# EAGLE design msgeq7ctrler_Elektor (EAGLE 7.2.0)
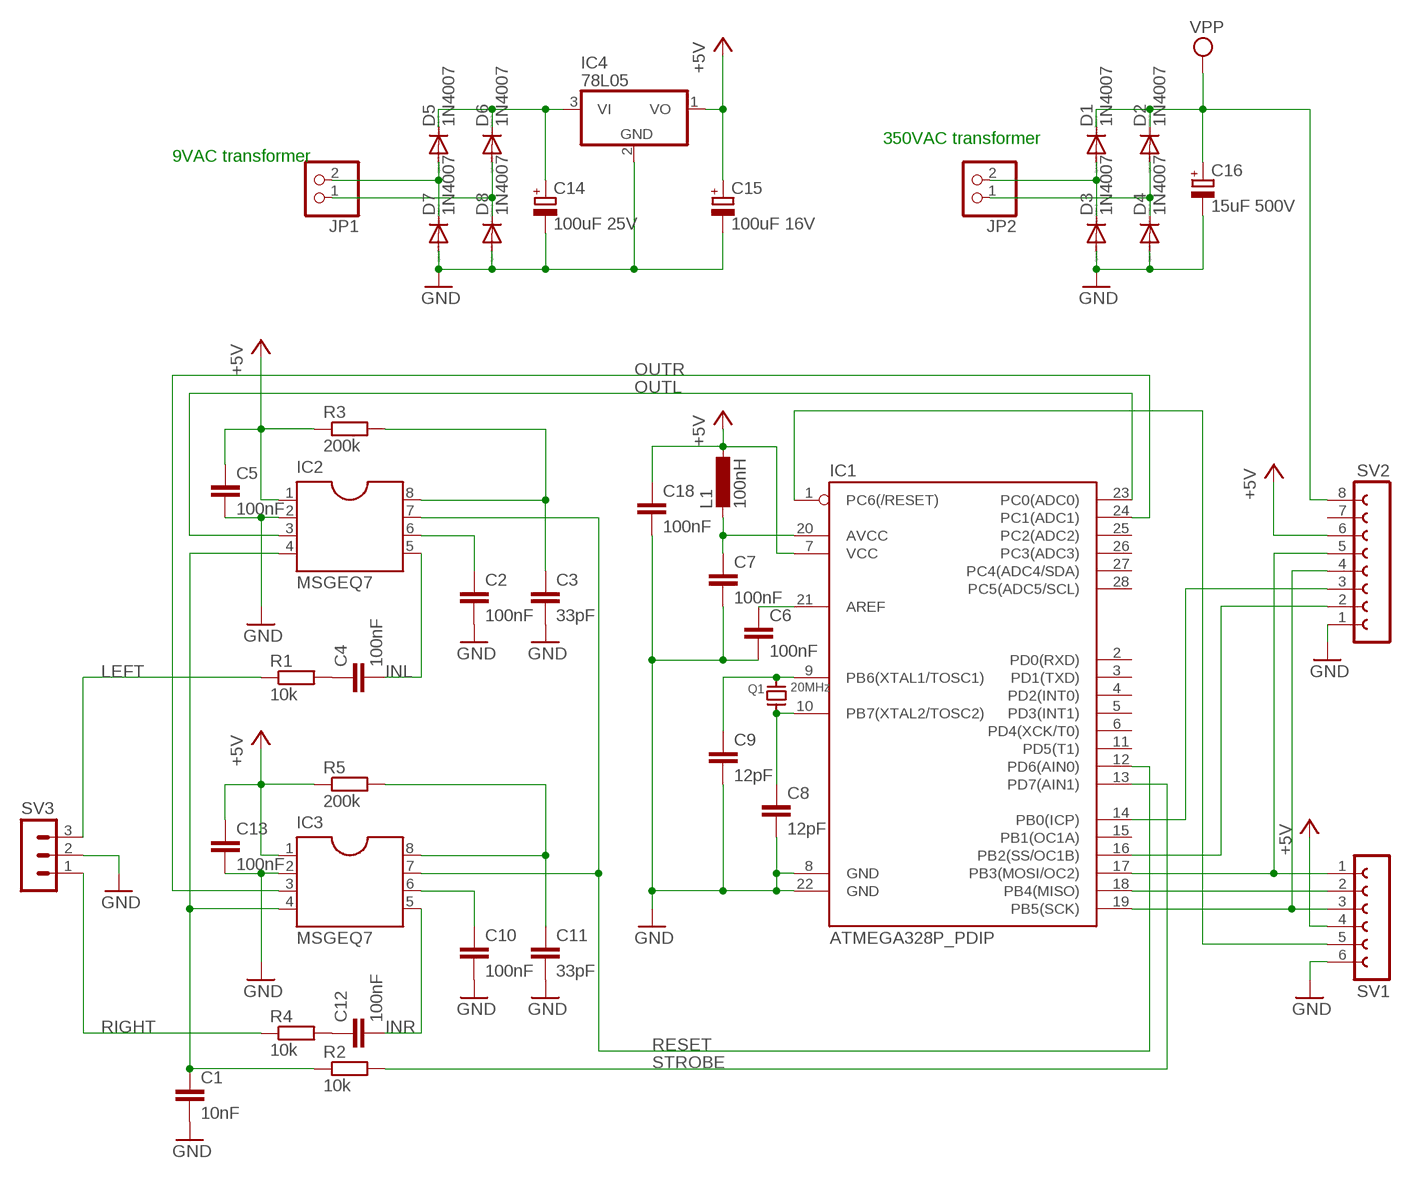
[diagram p0: schematic, sheet 1]

## Parts
C1  10nF  C-EU025-025X050  [C025-025X050]
C2  100nF  C-EU025-025X050  [C025-025X050]
C3  33pF  C-EU025-025X050  [C025-025X050]
C4  100nF  C-EU025-025X050  [C025-025X050]
C5  100nF  C-EU025-025X050  [C025-025X050]
C6  100nF  C-EU025-025X050  [C025-025X050]
C7  100nF  C-EU025-025X050  [C025-025X050]
C8  12pF  C-EU025-025X050  [C025-025X050]
C9  12pF  C-EU025-025X050  [C025-025X050]
C10  100nF  C-EU025-025X050  [C025-025X050]
C11  33pF  C-EU025-025X050  [C025-025X050]
C12  100nF  C-EU025-025X050  [C025-025X050]
C13  100nF  C-EU025-025X050  [C025-025X050]
C14  100uF 25V  CPOL-EUE2,5-6E  [E2,5-6E]
C15  100uF 16V  CPOL-EUE2,5-6E  [E2,5-6E]
C16  15uF 500V  CPOL-EUE10-20  [EB20D]
C18  100nF  C-EU025-025X050  [C025-025X050]
D1  1N4007  1N4004  [DO41-10]
D2  1N4007  1N4004  [DO41-10]
D3  1N4007  1N4004  [DO41-10]
D4  1N4007  1N4004  [DO41-10]
D5  1N4007  1N4004  [DO41-10]
D6  1N4007  1N4004  [DO41-10]
D7  1N4007  1N4004  [DO41-10]
D8  1N4007  1N4004  [DO41-10]
IC1  ATMEGA328P_PDIP  [DIL28-3]
IC2  MSGEQ7  DIL08  [DIL08]
IC3  MSGEQ7  DIL08  [DIL08]
IC4  78L05  78LXX  [TO92SIL]
JP1  PINHD-1X2  [1X02]
JP2  PINHD-1X2  [1X02]
L1  100nH  L-EU0207/10  [0207/10]
Q1  20MHz  XTAL  [XTAL]
R1  10k  R-EU_0207/12  [0207/12]
R2  10k  R-EU_0207/12  [0207/12]
R3  200k  R-EU_0207/12  [0207/12]
R4  10k  R-EU_0207/12  [0207/12]
R5  200k  R-EU_0207/12  [0207/12]
SV1  FE06-1  [FE06]
SV2  FE08-1  [FE08]
SV3  MA03-1  [MA03-1]

## Nets
+5V: C5.1 C13.1 C15.+ C18.1 IC1.7(VCC) IC2.1 IC3.1 IC4.1(VO) L1.1 R3.1 R5.1 SV1.4 SV2.6
GND: C1.2 C2.2 C3.2 C5.2 C6.2 C7.2 C8.2 C9.2 C10.2 C11.2 C13.2 C14.- C15.- C16.- C18.2 D3.A D4.A D7.A D8.A IC1.8(GND) IC1.22(GND) IC2.2 IC3.2 IC4.2(GND) SV1.6 SV2.1 SV3.2
INL: C4.2 IC2.5
INR: C12.2 IC3.5
LEFT: R1.1 SV3.3
N$2: C3.1 IC2.8 R3.2
N$3: C4.1 R1.2
N$5: C9.1 IC1.9(PB6(XTAL1/TOSC1)) Q1.P$2
N$6: C8.1 IC1.10(PB7(XTAL2/TOSC2)) Q1.P$1
N$7: C7.1 IC1.20(AVCC) L1.2
N$8: C6.1 IC1.21(AREF)
N$9: IC1.19(PB5(SCK)) SV1.3 SV2.4
N$10: IC1.18(PB4(MISO)) SV1.2
N$11: IC1.17(PB3(MOSI/OC2)) SV1.1 SV2.5
N$12: IC1.1(PC6(/RESET)) SV1.5
N$13: IC1.16(PB2(SS/OC1B)) SV2.2
N$14: IC1.14(PB0(ICP)) SV2.3
N$15: C11.1 IC3.8 R5.2
N$16: C12.1 R4.2
N$17: D1.A D3.C JP2.2
N$18: D2.A D4.C JP2.1
N$19: D5.A D7.C JP1.2
N$20: D6.A D8.C JP1.1
OUTL: IC1.23(PC0(ADC0)) IC2.3
OUTR: IC1.24(PC1(ADC1)) IC3.3
RESET: IC1.12(PD6(AIN0)) IC2.7 IC3.7
RIGHT: R4.1 SV3.1
STROBE: IC1.13(PD7(AIN1)) R2.2
STROBE_RC: C1.1 IC2.4 IC3.4 R2.1
VGND: C2.1 IC2.6
VGND1: C10.1 IC3.6
VPP: C16.+ D1.C D2.C SV2.8
VPP1: C14.+ D5.C D6.C IC4.3(VI)
Unconnected: IC1.2(PD0(RXD)) IC1.3(PD1(TXD)) IC1.4(PD2(INT0)) IC1.5(PD3(INT1)) IC1.6(PD4(XCK/T0)) IC1.11(PD5(T1)) IC1.15(PB1(OC1A)) IC1.25(PC2(ADC2)) IC1.26(PC3(ADC3)) IC1.27(PC4(ADC4/SDA)) IC1.28(PC5(ADC5/SCL)) SV2.7

## Notes on the sheet
- 350VAC transformer
- 9VAC transformer

## Library data of the parts
C1-C13 C18 = rcl:C-EU: CAPACITOR, European symbol
C14-C16 = rcl:CPOL-EU: POLARIZED CAPACITOR, European symbol
D1-D8 = diode:1N4004: DIODE general purpose rectifier, 1 A
IC1 = SparkFun-DigitalIC:ATMEGA328P_PDIP: uC used in the Arduino 32kb flash, 1k EEPROM, 2k SRAM This is the through-hole version of this chip.
IC2 IC3 = cvdo-dil-packages:DIL08
IC4 = 78xx79xxSIL:78LXX
JP1 JP2 = pinhead:PINHD-1X2: PIN HEADER
L1 = rcl:L-EU: INDUCTOR, European symbol
Q1 = xtal-cvdo:XTAL
R1-R5 = rcl:R-EU_: RESISTOR, European symbol
SV1 = con-lsta:FE06-1: FEMALE HEADER; OC_FARNELL: unknown; OC_NEWARK: unknown
SV2 = con-lsta:FE08-1: FEMALE HEADER; OC_FARNELL: unknown; OC_NEWARK: unknown
SV3 = con-lstb:MA03-1: PIN HEADER; OC_FARNELL: unknown; OC_NEWARK: unknown

## Board
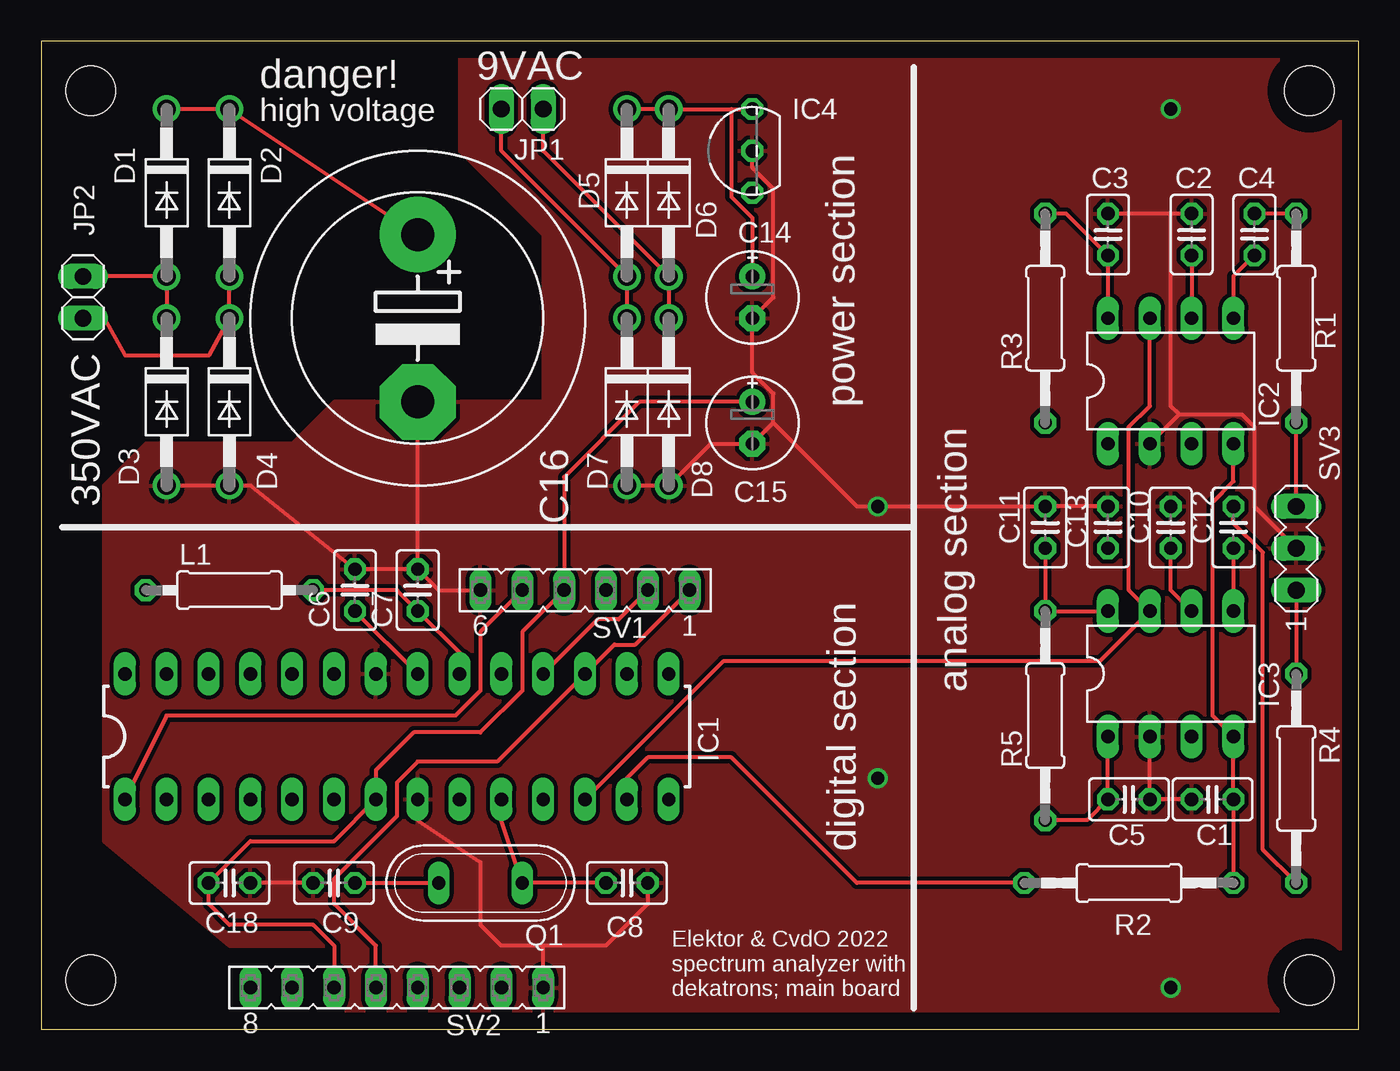
[diagram p1: board, top side]
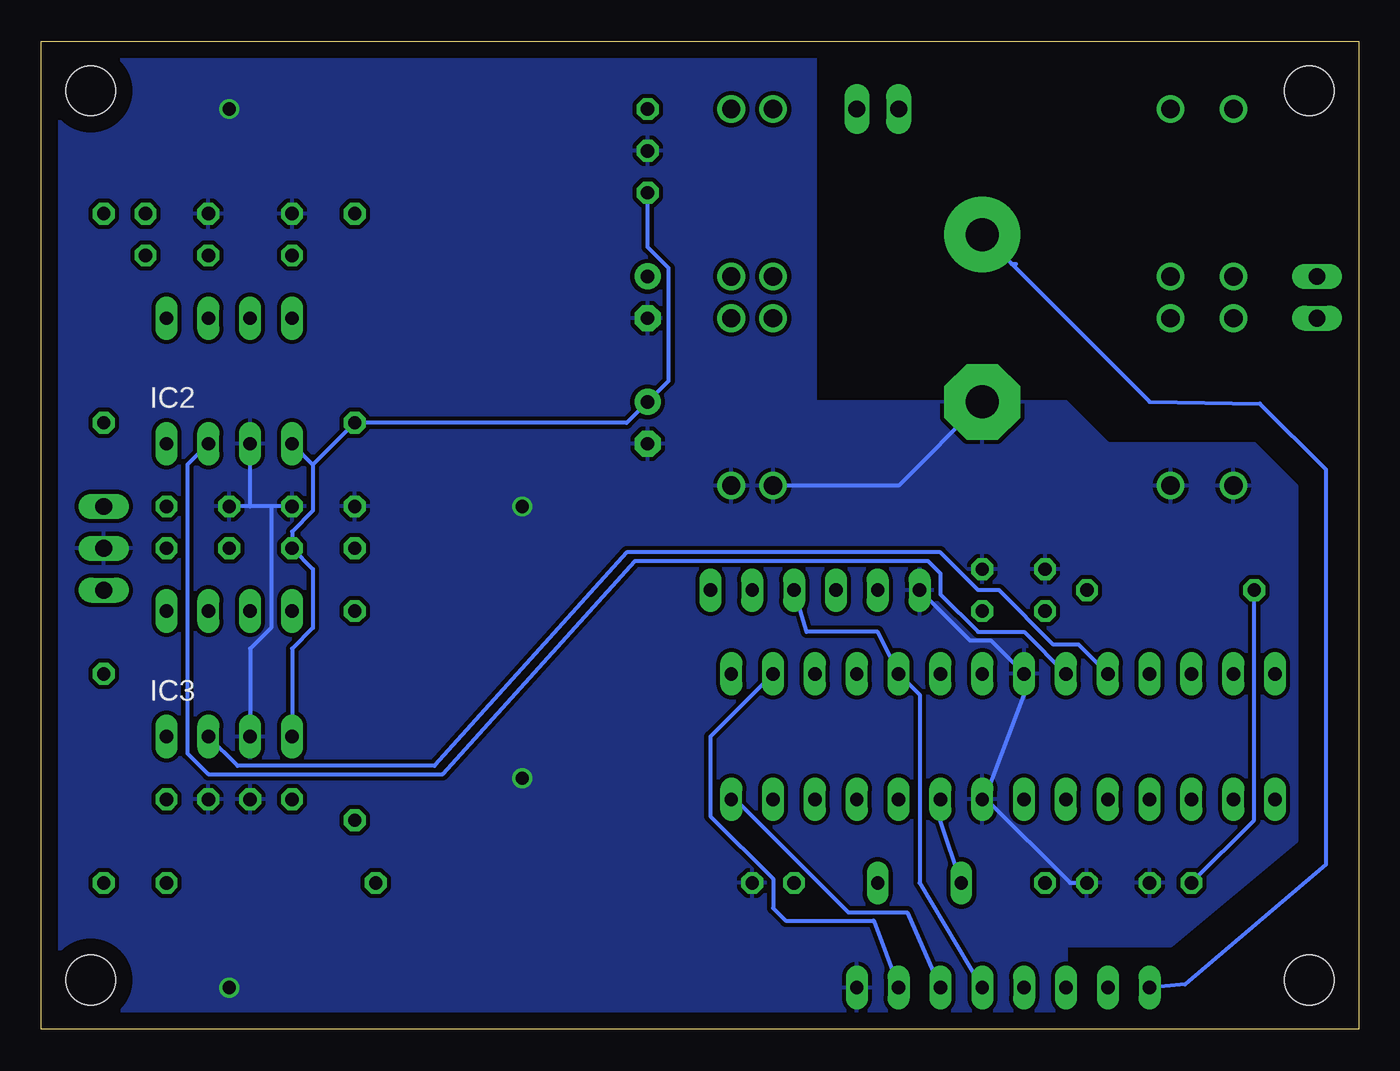
[diagram p2: board, bottom side, seen from below]

Size 80 x 60 mm. Coordinates in mm from the lower left corner, seen from the top.
Outline: 0,0 80,0 80,60 0,60 0,0
Copper layers (1*16): Top 0.035mm / dielectric 1.5mm / Bottom 0.035mm
Design rules "default *": minimum track width 10mil, minimum drill 24mil, track to track 10mil, track to pad 10mil, pad to pad 10mil, via to via 10mil, smd to smd 8mil, copper to edge 40mil, drill to drill 10mil, minimum pad ring 10mil, minimum via ring 8mil, stop-mask expansion 4mil, vias tented up to drill 0mil, thermal gap 10mil
Holes 3 mm at 3,3 77,3 77,57 3,57

### Footprints (pad centres in the part's own frame; a part is rotated, then mirrored left to right if it is on the bottom)
C025-025X050 = drill 0.813 octagon: 1 -1.27,0; 2 1.27,0
E2,5-6E = drill 0.813 pad 1.575: + -1.27,0 | drill 0.813 pad 1.575 octagon: - 1.27,0
EB20D = drill 2.007 pad 4.597: + -5.08,0 | drill 2.007 pad 4.597 octagon: - 5.08,0
DO41-10 = drill 1.118: A 5.08,0; C -5.08,0
DIL28-3 = drill 0.813 long: 1 -16.51,-3.81; 2 -13.97,-3.81; 3 -11.43,-3.81; 4 -8.89,-3.81; 5 -6.35,-3.81; 6 -3.81,-3.81; 7 -1.27,-3.81; 8 1.27,-3.81; 9 3.81,-3.81; 10 6.35,-3.81; 11 8.89,-3.81; 12 11.43,-3.81; 13 13.97,-3.81; 14 16.51,-3.81; 15 16.51,3.81; 16 13.97,3.81; 17 11.43,3.81; 18 8.89,3.81; 19 6.35,3.81; 20 3.81,3.81; 21 1.27,3.81; 22 -1.27,3.81; 23 -3.81,3.81; 24 -6.35,3.81; 25 -8.89,3.81; 26 -11.43,3.81; 27 -13.97,3.81; 28 -16.51,3.81
DIL08 = drill 0.813 long: 1 -2.54,-2.54; 2 0,-2.54; 3 2.54,-2.54; 4 5.08,-2.54; 5 5.08,5.08; 6 2.54,5.08; 7 0,5.08; 8 -2.54,5.08
TO92SIL = drill 0.813 octagon: 1 -2.54,0; 2 0,0; 3 2.54,0
1X02 = drill 1.016 long: 1 -1.27,0; 2 1.27,0
0207/10 = drill 0.813 octagon: 1 -5.08,0; 2 5.08,0
XTAL = drill 0.8 long: P$1 -2.54,0; P$2 2.54,0
0207/12 = drill 0.813 octagon: 1 -6.35,0; 2 6.35,0
FE06 = drill 0.813 long: 1 -6.35,0; 2 -3.81,0; 3 -1.27,0; 4 1.27,0; 5 3.81,0; 6 6.35,0
FE08 = drill 0.813 long: 1 -8.89,0; 2 -6.35,0; 3 -3.81,0; 4 -1.27,0; 5 1.27,0; 6 3.81,0; 7 6.35,0; 8 8.89,0
MA03-1 = drill 1.016 long: 1 -2.54,0; 2 0,0; 3 2.54,0

### Placement (x,y rotation side)
C1  71.12,13.97 180 top
C2  69.85,48.26 90 top
C3  64.77,48.26 90 top
C4  73.66,48.26 270 top
C5  66.04,13.97 0 top
C6  19.05,26.67 90 top
C7  22.86,26.67 90 top
C8  35.56,8.89 0 top
C9  17.78,8.89 180 top
C10  68.58,30.48 90 top
C11  60.96,30.48 90 top
C12  72.39,30.48 270 top
C13  64.77,30.48 90 top
C14  43.18,44.45 270 top
C15  43.18,36.83 270 top
C16  22.86,43.18 270 top
C18  11.43,8.89 0 top
D1  7.62,50.8 270 top
D2  11.43,50.8 270 top
D3  7.62,38.1 270 top
D4  11.43,38.1 270 top
D5  35.56,50.8 270 top
D6  38.1,50.8 270 top
D7  35.56,38.1 270 top
D8  38.1,38.1 270 top
IC1  21.59,17.78 0 top
IC2  67.31,38.1 0 top
IC3  67.31,20.32 0 top
IC4  43.18,53.34 90 top
JP1  29.21,55.88 180 top
JP2  2.54,44.45 90 top
L1  11.43,26.67 0 top
Q1  26.67,8.89 180 top
R1  76.2,43.18 90 top
R2  66.04,8.89 180 top
R3  60.96,43.18 90 top
R4  76.2,15.24 270 top
R5  60.96,19.05 90 top
SV1  33.02,26.67 180 top
SV2  21.59,2.54 180 top
SV3  76.2,29.21 90 top

### Tracks (layer width: path | path; a pad name or v marks a point on that pad's centre or on a via)
+5V
  Top 0.254: SV2.6 17.78,5.08 16.51,6.35 11.43,6.35 10.16,7.62 C18.1 12.7,11.43 17.78,11.43 IC1.7 20.32,15.75 22.61,18.03 26.67,18.03 29.21,20.57 29.21,24.13 SV1.4 31.75,33.53 36.32,38.1 C15.+ | R5.1 63.5,12.7 C5.1 IC3.1
  Bottom 0.254: L1.1 6.35,12.7 C18.1 | 63.5,34.29 63.5,31.5 64.77,30.23 C13.1 63.5,27.94 63.5,24.38 64.77,23.11 IC3.1 | IC2.1 63.5,34.29 | 63.5,34.29 R3.1 44.45,36.83 C15.+ 41.91,39.37 41.91,46.23 43.18,47.5 IC4.1
GND  (via drill 0.8)
  Top 0.254: C1.2 C5.2 IC3.2 | C2.2 68.58,49.53 | 68.58,49.53 C3.2 | C13.2 C11.2 v50.8,31.75 49.53,31.75 44.45,36.83 | SV3.2 73.66,31.75 73.66,36.58 72.9,37.34 69.09,37.34 | IC2.2 69.09,37.34 | 68.58,49.53 68.58,37.85 69.09,37.34 | C9.2 C18.2 | IC4.2 43.18,52.32 44.45,51.05 44.45,44.45 C14.- 43.18,39.88 44.45,38.61 44.45,36.83 | D7.A D8.A 40.64,35.56 C15.- 44.45,36.83 | D3.A D4.A 12.7,33.02 C6.2 C7.2 | SV1.6 24.13,26.67 C7.2 | C7.2 C16.- | IC1.8 22.86,12.7 26.67,10.16 26.67,6.35 27.94,5.08 30.48,5.08 | C8.2 36.83,7.62 34.29,5.08 30.48,5.08 | SV2.1 30.48,5.08
  Bottom 0.254: C13.2 66.04,31.75 | 66.04,31.75 67.31,31.75 | 67.31,31.75 C10.2 | 67.31,31.75 IC2.2 | IC3.2 67.31,23.11 66.04,24.38 66.04,31.75 | 22.61,14.22 20.32,20.32 IC1.22 22.35,23.62 23.62,23.62 SV1.6 | C9.2 17.53,8.89 22.61,13.97 22.61,14.22 | 22.61,14.22 IC1.8 | D7.A 27.94,33.02 C16.-
  other vias: 50.8,15.24 68.58,2.54 68.58,55.88
  pour Bottom: 17.78,0 80.01,0 80.01,59.69 33.02,59.69 33.02,38.1 17.78,38.1 15.24,35.56 6.35,35.56 3.81,33.02 3.81,11.43 11.43,5.08 17.78,5.08
  pour Top: 17.78,0 80.01,0 80.01,59.69 25.4,59.69 25.4,53.34 30.48,48.26 30.48,38.1 17.78,38.1 15.24,35.56 6.35,35.56 3.81,33.02 3.81,11.43 11.43,5.08 17.78,5.08
INL
  Top 0.254: IC2.5 72.39,45.72 C4.2
INR
  Top 0.254: C12.2 IC3.5
LEFT
  Top 0.254: SV3.3 R1.1
N$2
  Top 0.254: R3.2 62.23,49.53 C3.1 IC2.8
N$3
  Top 0.254: R1.2 C4.1
N$5
  Top 0.254: C9.1 Q1.P$2
  Bottom 0.254: IC1.9 25.4,12.7 Q1.P$2
N$6
  Top 0.254: C8.1 Q1.P$1 27.94,12.7 IC1.10
N$7
  Top 0.254: IC1.20 25.4,22.86 C7.1 21.59,26.67 L1.2
N$8
  Top 0.254: IC1.21 C6.1
N$9
  Bottom 0.254: SV2.4 26.67,8.89 26.67,20.32 IC1.19 29.21,24.13 33.53,24.13 SV1.3
N$10
  Top 0.254: IC1.18 33.78,24.89 35.05,24.89 SV1.2
N$11
  Top 0.254: SV1.1 36.07,23.37 34.8,23.37 IC1.17 27.69,16.26 22.86,16.26 21.59,14.99 21.59,12.95 17.78,9.14 17.78,7.62 20.32,5.08 SV2.5
N$12
  Top 0.254: IC1.1 7.62,19.05 25.15,19.05 26.67,20.57 26.67,24.13 SV1.5
N$13
  Bottom 0.254: SV2.2 29.46,6.6 34.8,6.6 35.56,7.37 35.56,9.14 39.37,12.95 39.37,17.78 IC1.16
N$14
  Bottom 0.254: SV2.3 27.43,7.11 30.99,7.11 37.85,13.97 IC1.14
N$15
  Top 0.254: C11.1 R5.2 IC3.8
N$16
  Top 0.254: C12.1 72.39,30.73 74.17,28.96 74.17,10.92 R4.2
N$17
  Top 0.254: JP2.2 D1.A D3.C
N$18
  Top 0.254: JP2.1 3.84,43.18 5.11,40.91 10.16,40.91 D4.C D2.A
N$19
  Top 0.254: JP1.2 27.94,53.34 D5.A D7.C
N$20
  Top 0.254: JP1.1 30.48,53.34 D6.A D8.C
OUTL
  Bottom 0.254: IC1.23 20.32,24.13 23.11,24.13 25.4,26.42 25.4,27.69 26.16,28.45 43.94,28.45 55.63,15.49 69.85,15.49 71.12,16.76 71.12,34.29 IC2.3
OUTR
  Bottom 0.254: IC3.3 68.07,16 56.13,16 44.45,28.96 25.4,28.96 23.11,26.67 21.84,26.67 18.54,23.37 17.02,23.37 IC1.24
RESET
  Top 0.254: IC1.12 41.4,22.35 64.26,22.35 IC3.7 66.04,26.67 66.04,36.58 67.31,37.85 IC2.7
RIGHT
  Top 0.254: SV3.1 R4.1
STROBE
  Top 0.254: IC1.13 35.56,15.24 36.83,16.51 41.91,16.51 49.53,8.89 R2.2
STROBE_RC
  Top 0.254: R2.1 C1.1 IC3.4 71.12,19.05 71.12,32 72.39,33.27 IC2.4
VGND
  Top 0.254: C2.1 IC2.6
VGND1
  Top 0.254: C10.1 68.58,26.67 IC3.6
VPP
  Top 0.254: D1.C D2.C C16.+
  Bottom 0.254: C16.+ 21.08,46.48 | 21.08,46.48 12.7,38.1 6,38 2,34 2,10 10.54,2.73 SV2.8 | 21.08,46.48 20.83,46.48
VPP1
  Top 0.254: 41.91,55.88 D6.C D5.C | 41.91,55.88 IC4.3 | C14.+ 43.18,49.28 41.91,50.55 41.91,55.88

### Text on the board
tPlace: 9VAC | danger! | high voltage | power section | 350VAC | analog section | digital section
tNames: IC2 | IC3 | Elektor & CvdO 2022 / spectrum analyzer with / dekatrons; main board